# Altium schematic sheet mcu.SchDoc
size A3
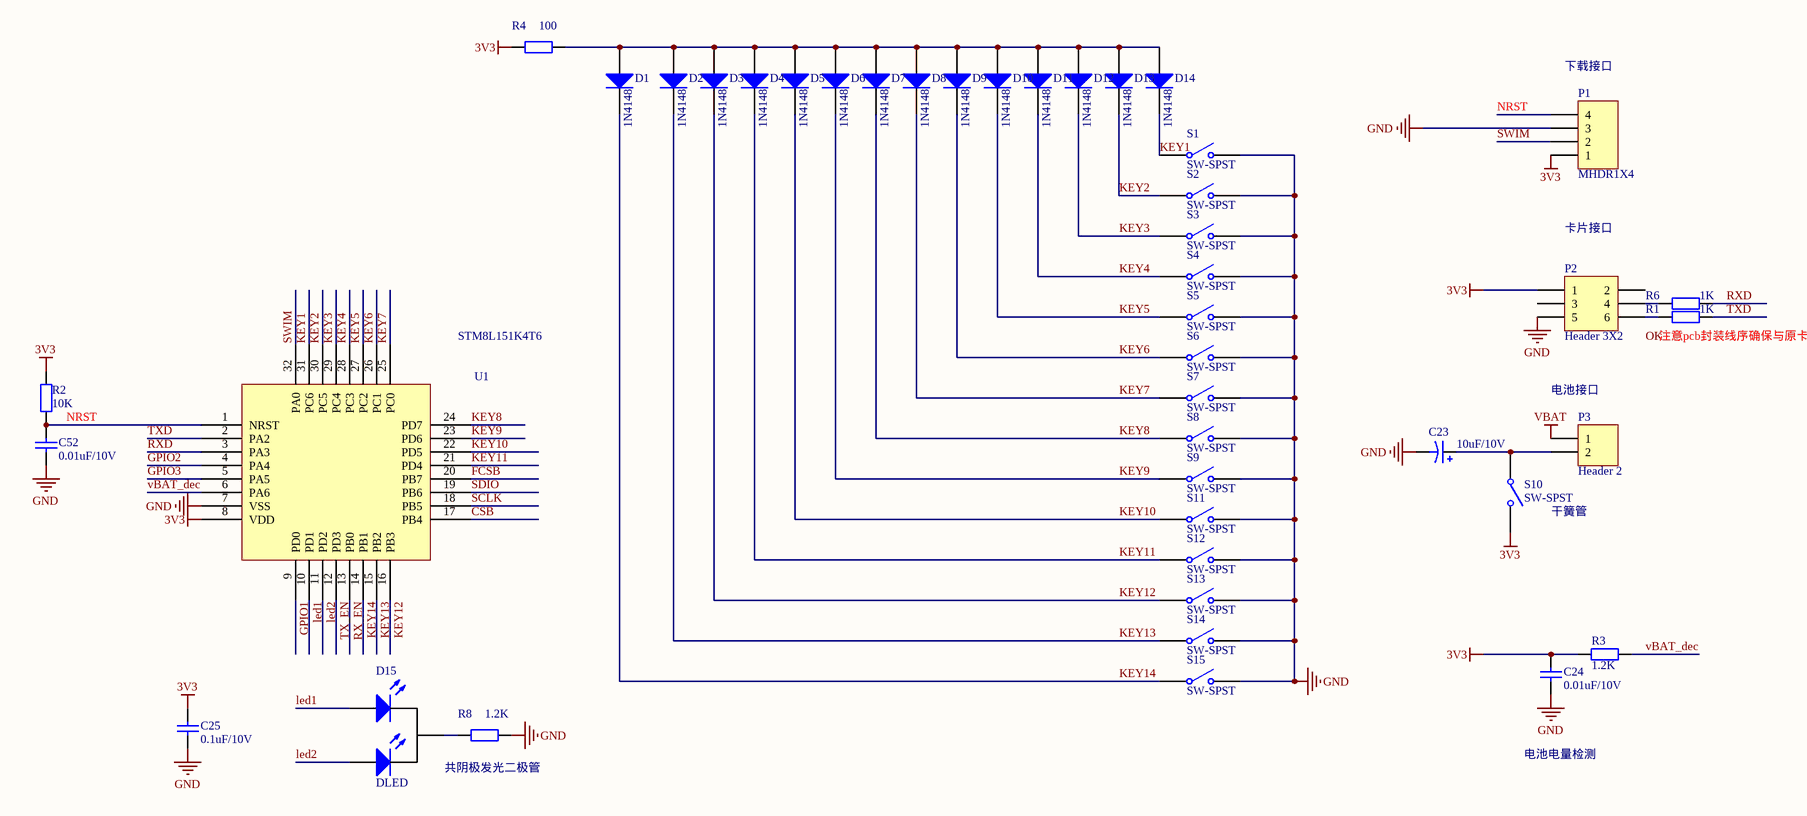
[diagram p0: mcu.SchDoc]

## Parts
C23  10uF/10V
C24  0.01uF/10V  [0603C]
C25  0.1uF/10V  [0603C]
C52  0.01uF/10V  [0603C]
D1  1N4148
D2  1N4148
D3  1N4148
D4  1N4148
D5  1N4148
D6  1N4148
D7  1N4148
D8  1N4148
D9  1N4148
D10  1N4148
D11  1N4148
D12  1N4148
D13  1N4148
D14  1N4148
D15  DLED
P1  MHDR1X4  [SIP4]
P2  Header 3X2
P3  Header 2
R1  1K  [0603R]
R2  10K  [0603R]
R3  1.2K  [0603R]
R4  100  [0603R]
R6  1K  [0603R]
R8  1.2K  [0603R]
S1  SW-SPST
S2  SW-SPST
S3  SW-SPST
S4  SW-SPST
S5  SW-SPST
S6  SW-SPST
S7  SW-SPST
S8  SW-SPST
S9  SW-SPST
S10  SW-SPST
S11  SW-SPST
S12  SW-SPST
S13  SW-SPST
S14  SW-SPST
S15  SW-SPST
U1  STM8L151K4T6  [QFP80P900X900X245-32N]

## Nets
3V3: C24.1 C25.1 P1.1 P2.1 R2.2 R3.2 R4.2 S10.2(NO) U1.8(VDD)
GND: C23.2 C24.2 C25.2 C52.2 P1.3 P2.5 R8.1 S1.2(NO) S2.2(NO) S3.2(NO) S4.2(NO) S5.2(NO) S6.2(NO) S7.2(NO) S8.2(NO) S9.2(NO) S11.2(NO) S12.2(NO) S13.2(NO) S14.2(NO) S15.2(NO) U1.7(VSS)
VBAT: P3.1
CSB: U1.17(PB4)
FCSB: U1.20(PB7)
GPIO1: U1.9(PD0)
GPIO2: U1.4(PA4)
GPIO3: U1.5(PA5)
KEY1: D14.2(K) S1.1(COMMON) U1.31(PC6)
KEY2: D13.2(K) S2.1(COMMON) U1.30(PC5)
KEY3: D12.2(K) S3.1(COMMON) U1.29(PC4)
KEY4: D11.2(K) S4.1(COMMON) U1.28(PC3)
KEY5: D10.2(K) S5.1(COMMON) U1.27(PC2)
KEY6: D9.2(K) S6.1(COMMON) U1.26(PC1)
KEY7: D8.2(K) S7.1(COMMON) U1.25(PC0)
KEY8: D7.2(K) S8.1(COMMON) U1.24(PD7)
KEY9: D6.2(K) S9.1(COMMON) U1.23(PD6)
KEY10: D5.2(K) S11.1(COMMON) U1.22(PD5)
KEY11: D4.2(K) S12.1(COMMON) U1.21(PD4)
KEY12: D3.2(K) S13.1(COMMON) U1.16(PB3)
KEY13: D2.2(K) S14.1(COMMON) U1.15(PB2)
KEY14: D1.2(K) S15.1(COMMON) U1.14(PB1)
led1: D15.1(A) U1.10(PD1)
led2: D15.3(A) U1.11(PD2)
NRST: C52.1 P1.4 R2.1 U1.1(NRST)
RX_EN: U1.13(PB0)
RXD: R6.1 U1.3(PA3)
SCLK: U1.18(PB5)
SDIO: U1.19(PB6)
SWIM: P1.2 U1.32(PA0)
TX_EN: U1.12(PD3)
TXD: R1.1 U1.2(PA2)
vBAT_dec: R3.1 U1.6(PA6)
NetC23_1: C23.1 P3.2 S10.1(COMMON)
NetD1_1: D1.1(A) D2.1(A) D3.1(A) D4.1(A) D5.1(A) D6.1(A) D7.1(A) D8.1(A) D9.1(A) D10.1(A) D11.1(A) D12.1(A) D13.1(A) D14.1(A) R4.1
NetD15_2: D15.2(K) R8.2
NetP2_4: P2.4 R6.2
NetP2_6: P2.6 R1.2

Not connected (* = marked no-connect by the designer): P2 2 3

## Notes on the sheet
- (near P1) 下载接口
- 卡片接口
- (near R1) 注意pcb封装线序确保与原卡片接口一致
- (near P3) 电池接口
- 干簧管
- 共阴极发光二极管
- 电池电量检测
- Labels drawn without touching a wire or pin: OK

## Library data of the parts
C23 = Cap Pol1: Polarized Capacitor (Radial); Value: 100pF; Published: 8-Jun-2000; LatestRevisionDate: 17-Jul-2002; LatestRevisionNote: Re-released for DXP Platform.; PackageReference: RB7.6-15; Publisher: Altium Limited
C24 C25 C52 = Cap: Capacitor; Value: 106; Published: 8-Jun-2000; LatestRevisionDate: 17-Jul-2002; LatestRevisionNote: Re-released for DXP Platform.; PackageReference: RAD-0.3; Publisher: Altium Limited
D1-D14 = Diode: Default Diode; Published: 8-Jun-2000; LatestRevisionDate: 17-Jul-2002; LatestRevisionNote: Re-released for DXP Platform.; PackageVersion: Sep-1996; PackageReference: SMC; Publisher: Altium Limited; Code_JEDEC: DO-214-AB
P1 = MHDR1X4: Header, 4-Pin; LatestRevisionDate: 17-Jul-2002; LatestRevisionNote: Re-released for DXP Platform.; Publisher: Altium Limited
P2 = Header 3X2: Header, 3-Pin, Dual row; LatestRevisionDate: 17-Jul-2002; LatestRevisionNote: Re-released for DXP Platform.; Publisher: Altium Limited
P3 = Header 2: Header, 2-Pin; LatestRevisionDate: 17-Jul-2002; LatestRevisionNote: Re-released for DXP Platform.; Publisher: Altium Limited
R1-R4 R6 R8 = Res2: Resistor; Value: 10K/5%/1/8W; Published: 8-Jun-2000; LatestRevisionDate: 17-Jul-2002; LatestRevisionNote: Re-released for DXP Platform.; PackageReference: AXIAL-0.4; Publisher: Altium Limited
S1-S15 = SW-SPST: Single-Pole, Single-Throw Switch; Published: 24-Mar-1999; LatestRevisionDate: 17-Jul-2002; LatestRevisionNote: Re-released for DXP Platform.; PackageReference: SPST-2; Publisher: Altium Limited